# EAGLE design MCUBOARD-2-V.1.0 (EAGLE 5.06)

## Sheet 1 of 3
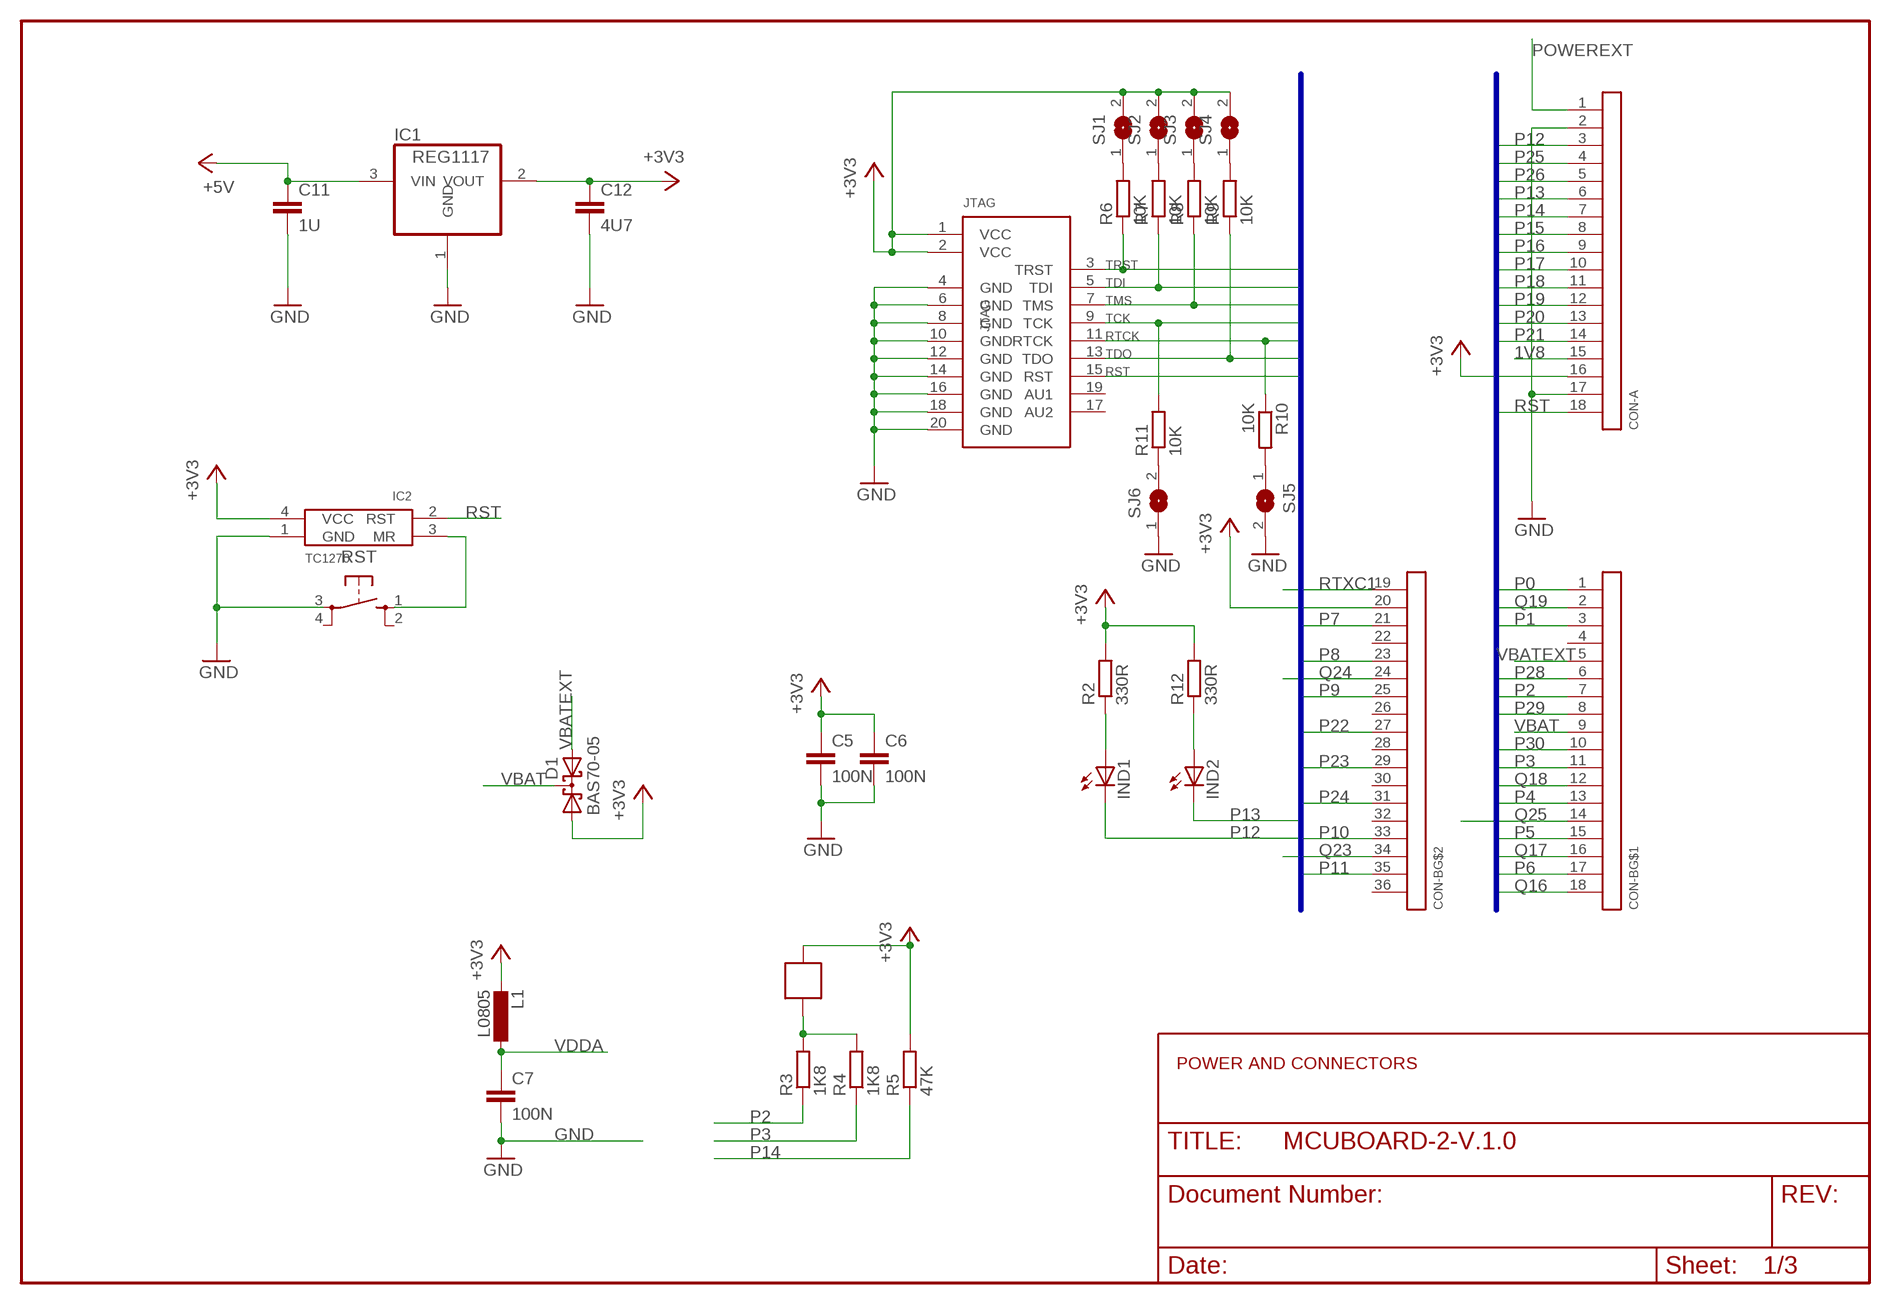
[diagram p0: schematic, sheet 1]

### Parts
C5  100N  C-EUC0805  [C0805]
C6  100N  C-EUC0805  [C0805]
C7  100N  C-EUC0603  [C0603]
C11  1U  C-EUC0805  [C0805]
C12  4U7  C-EUC0805  [C0805]
CON-A  CON18ARMCON  [CON-ARMED-18-1]
CON-B  CON18-2  [CON-ARMED-18-2]
D1  BAS70-05  [SOT23]
IC1  REG1117  [SOT223]
IC2  TC1270  [SOT143R_INFINEON]
IND1  LEDCHIPLED_0805  [CHIPLED_0805]
IND2  LEDCHIPLED_0805  [CHIPLED_0805]
JMP2  SOLDERJUMPER  [SOLDERJUMP1]
JTAG  ARM-JTAGVERTIKAL  [ML20]
L1  L0805  [C0805]
R2  330R  R-EU_M0805  [M0805]
R3  1K8  R-EU_M0805  [M0805]
R4  1K8  R-EU_M0805  [M0805]
R5  47K  R-EU_M0805  [M0805]
R6  10K  R-EU_M0805  [M0805]
R7  10K  R-EU_M0805  [M0805]
R8  10K  R-EU_M0805  [M0805]
R9  10K  R-EU_M0805  [M0805]
R10  10K  R-EU_M0805  [M0805]
R11  10K  R-EU_M0805  [M0805]
R12  330R  R-EU_M0805  [M0805]
RST  10XXSMD  [B3F-10XX-SMD]
SJ1  SJ  [SJ]
SJ2  SJ  [SJ]
SJ3  SJ  [SJ]
SJ4  SJ  [SJ]
SJ5  SJ  [SJ]
SJ6  SJ  [SJ]

### Nets
1V8: CON-A.15
+3V3: C5.1 C6.1 C12.1 CON-A.16 CON-B.20 D1.1(A1) IC1.2(VOUT) IC2.4(VCC) JMP2.2 JTAG.1(VCC) JTAG.2(VCC) L1.2 R2.2 R5.2 R12.2 SJ1.2 SJ2.2 SJ3.2 SJ4.2 ; also sheet 3
+5V: C11.1 IC1.3(VIN) ; also sheet 2
GND: C5.2 C6.2 C7.2 C11.2 C12.2 CON-A.2 CON-A.17 IC1.1(GND) IC2.1(GND) JTAG.4(GND) JTAG.6(GND) JTAG.8(GND) JTAG.10(GND) JTAG.12(GND) JTAG.14(GND) JTAG.16(GND) JTAG.18(GND) JTAG.20(GND) RST.3 SJ5.2 SJ6.1 ; also sheet 2,3
N$1: IC2.3(MR) RST.1
N$2: R6.2 SJ1.1
N$3: IND1.A R2.1
N$5: R7.2 SJ2.1
N$6: R8.2 SJ3.1
N$7: R9.2 SJ4.1
N$8: R10.2 SJ5.1
N$9: R11.1 SJ6.2
N$12: IND2.A R12.1
N$13: JMP2.1 R3.2 R4.2
P0: CON-B.1 ; also sheet 3
P1: CON-B.3 ; also sheet 3
P2: CON-B.7 R3.1 ; also sheet 3
P3: CON-B.11 R4.1 ; also sheet 3
P4: CON-B.13 ; also sheet 3
P5: CON-B.15 ; also sheet 3
P6: CON-B.17 ; also sheet 3
P7: CON-B.21 ; also sheet 3
P8: CON-B.23 ; also sheet 3
P9: CON-B.25 ; also sheet 3
P10: CON-B.33 ; also sheet 3
P11: CON-B.35 ; also sheet 3
P12: CON-A.3 IND1.C ; also sheet 3
P13: CON-A.6 IND2.C ; also sheet 3
P14: CON-A.7 R5.1 ; also sheet 3
P15: CON-A.8 ; also sheet 3
P16: CON-A.9 ; also sheet 3
P17: CON-A.10 ; also sheet 3
P18: CON-A.11 ; also sheet 3
P19: CON-A.12 ; also sheet 3
P20: CON-A.13 ; also sheet 3
P21: CON-A.14 ; also sheet 3
P22: CON-B.27 ; also sheet 3
P23: CON-B.29
P24: CON-B.31
P25: CON-A.4 ; also sheet 3
P26: CON-A.5
P28: CON-B.6 ; also sheet 3
P29: CON-B.8 ; also sheet 3
P30: CON-B.10 ; also sheet 3
POWEREXT: CON-A.1 ; also sheet 2
Q16: CON-B.18 ; also sheet 3
Q17: CON-B.16 ; also sheet 3
Q18: CON-B.12 ; also sheet 3
Q19: CON-B.2 ; also sheet 3
Q23: CON-B.34 ; also sheet 3
Q24: CON-B.24 ; also sheet 3
Q25: CON-B.14 ; also sheet 3
RST: CON-A.18 IC2.2(RST) JTAG.15(RST) ; also sheet 3
RTCK: JTAG.11(RTCK) R10.1 ; also sheet 3
RTXC1: CON-B.19 ; also sheet 3
TCK: JTAG.9(TCK) R11.2 ; also sheet 3
TDI: JTAG.5(TDI) R7.1 ; also sheet 3
TDO: JTAG.13(TDO) R9.1 ; also sheet 3
TMS: JTAG.7(TMS) R8.1 ; also sheet 3
TRST: JTAG.3(TRST) R6.1 ; also sheet 3
VBAT: CON-B.9 D1.3(C) ; also sheet 3
VBATEXT: CON-B.5 D1.2(A2)
VDDA: C7.1 L1.1 ; also sheet 3
Unconnected: CON-B.4 CON-B.22 CON-B.26 CON-B.28 CON-B.30 CON-B.32 CON-B.36 JTAG.17(AU2) JTAG.19(AU1) RST.2 RST.4

### Buses
P[0..31],Q[16..31],RST

### Notes on the sheet
- POWER AND CONNECTORS

## Sheet 2 of 3
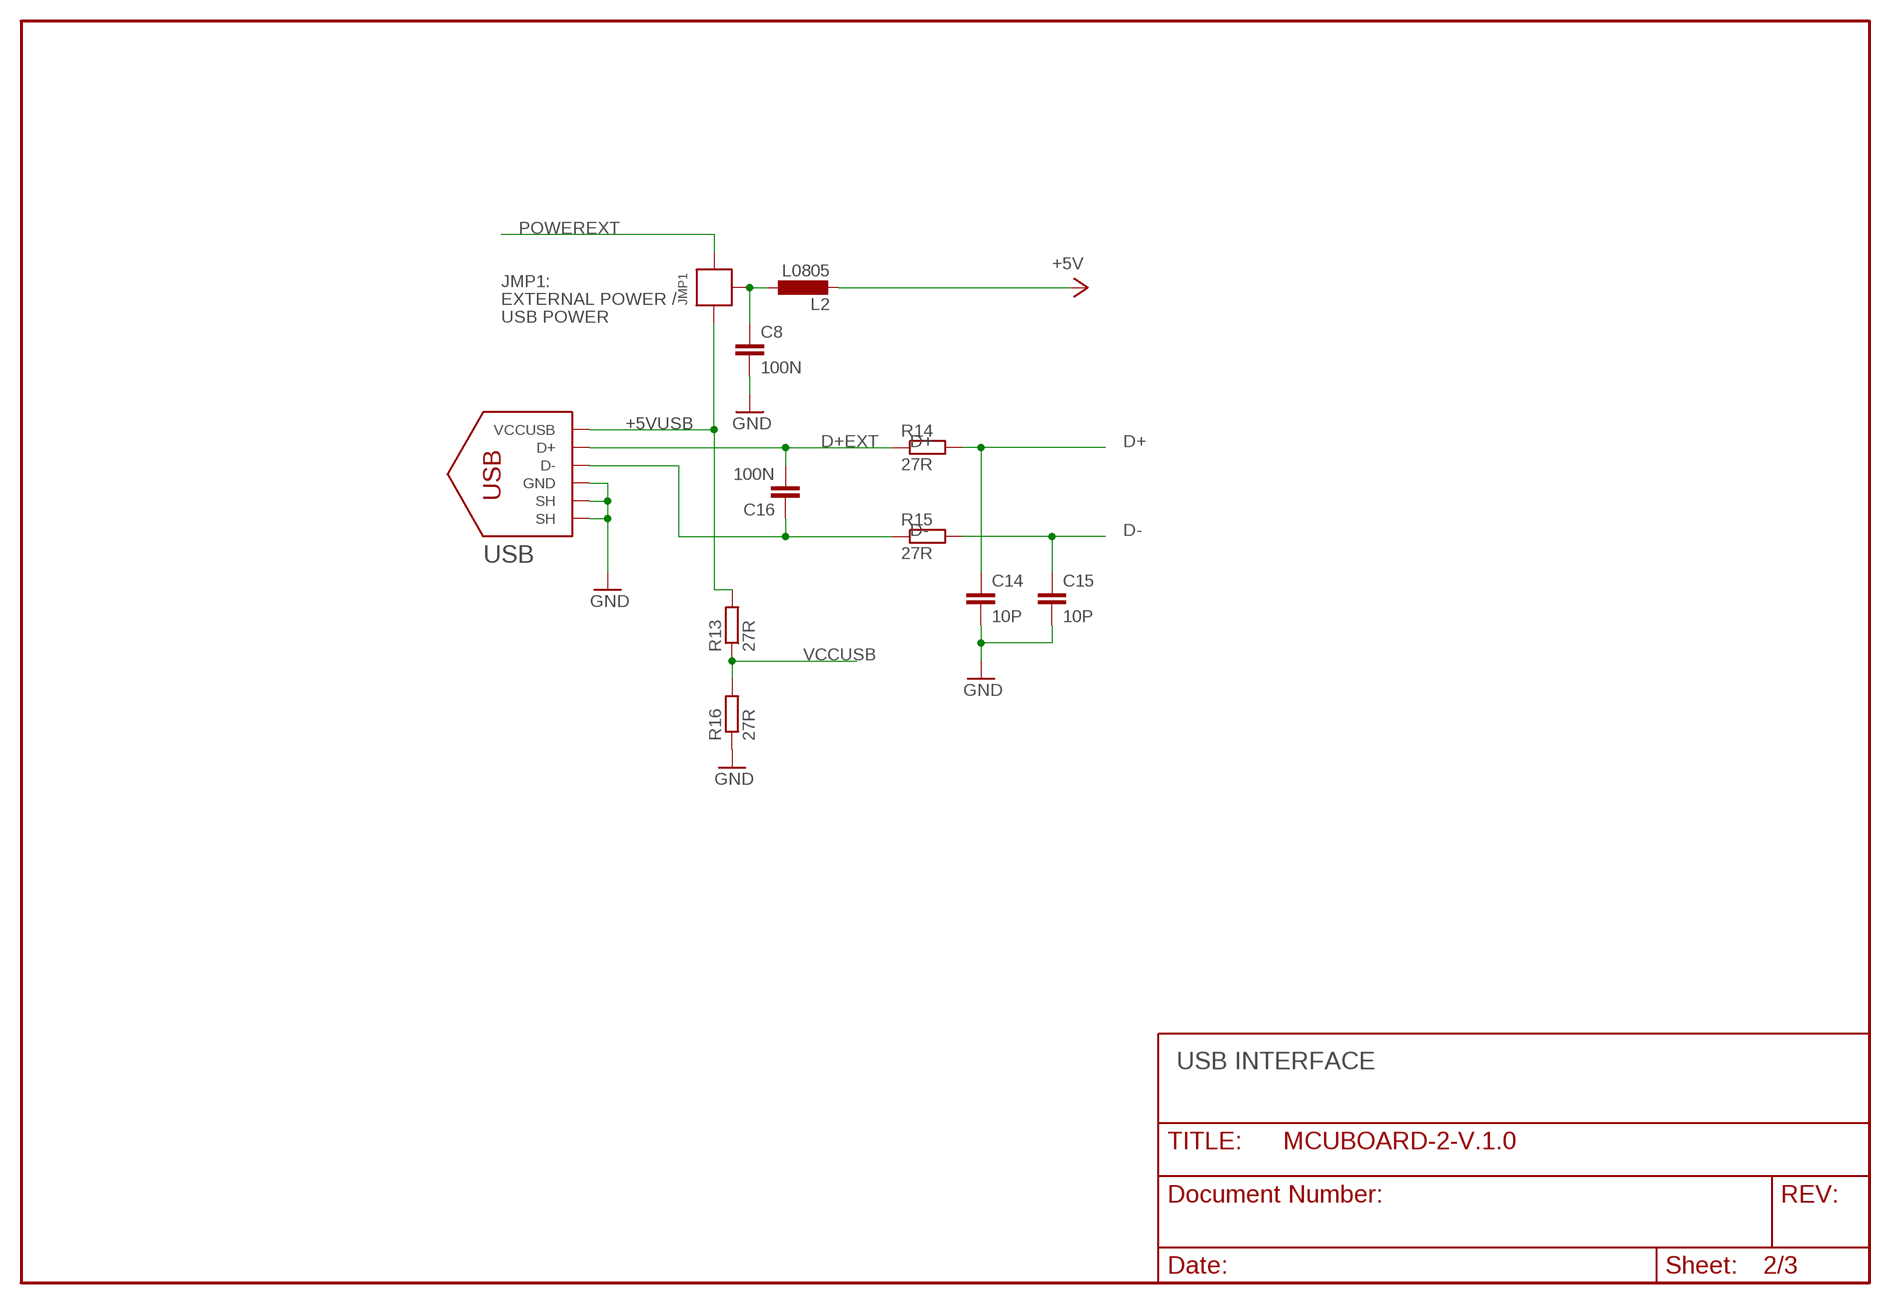
[diagram p1: schematic, sheet 2]

### Parts
C8  100N  C-EUC0805  [C0805]
C14  10P  C-EUC0805  [C0805]
C15  10P  C-EUC0805  [C0805]
C16  100N  C-EUC0805  [C0805]
JMP1  JUMPER3  [SOLDERJUMP3-1]
L2  L0805  [C0805]
R13  27R  R-EU_R0805  [R0805]
R14  27R  R-EU_R0805  [R0805]
R15  27R  R-EU_R0805  [R0805]
R16  27R  R-EU_R0805  [R0805]
USB  USBCONNMINI-B-HOLE  [USB-MB-H]

### Nets
+5V: L2.2 ; also sheet 1
+5VUSB: JMP1.3 R13.2 USB.VBUS(VCCUSB)
D+: C14.1 R14.2 ; also sheet 3
D+EXT: C16.2 R14.1 USB.D+ ; also sheet 3
D-: C15.1 R15.2 ; also sheet 3
D-EXT: C16.1 R15.1 USB.D-
GND: C8.2 C14.2 C15.2 R16.1 USB.GND USB.GND@1(SH) USB.GND@2(SH) ; also sheet 1,3
N$14: C8.1 JMP1.2 L2.1
POWEREXT: JMP1.1 ; also sheet 1
VCCUSB: R13.1 R16.2 ; also sheet 3

### Notes on the sheet
- JMP1:
- EXTERNAL POWER /
- USB POWER
- USB INTERFACE

## Sheet 3 of 3
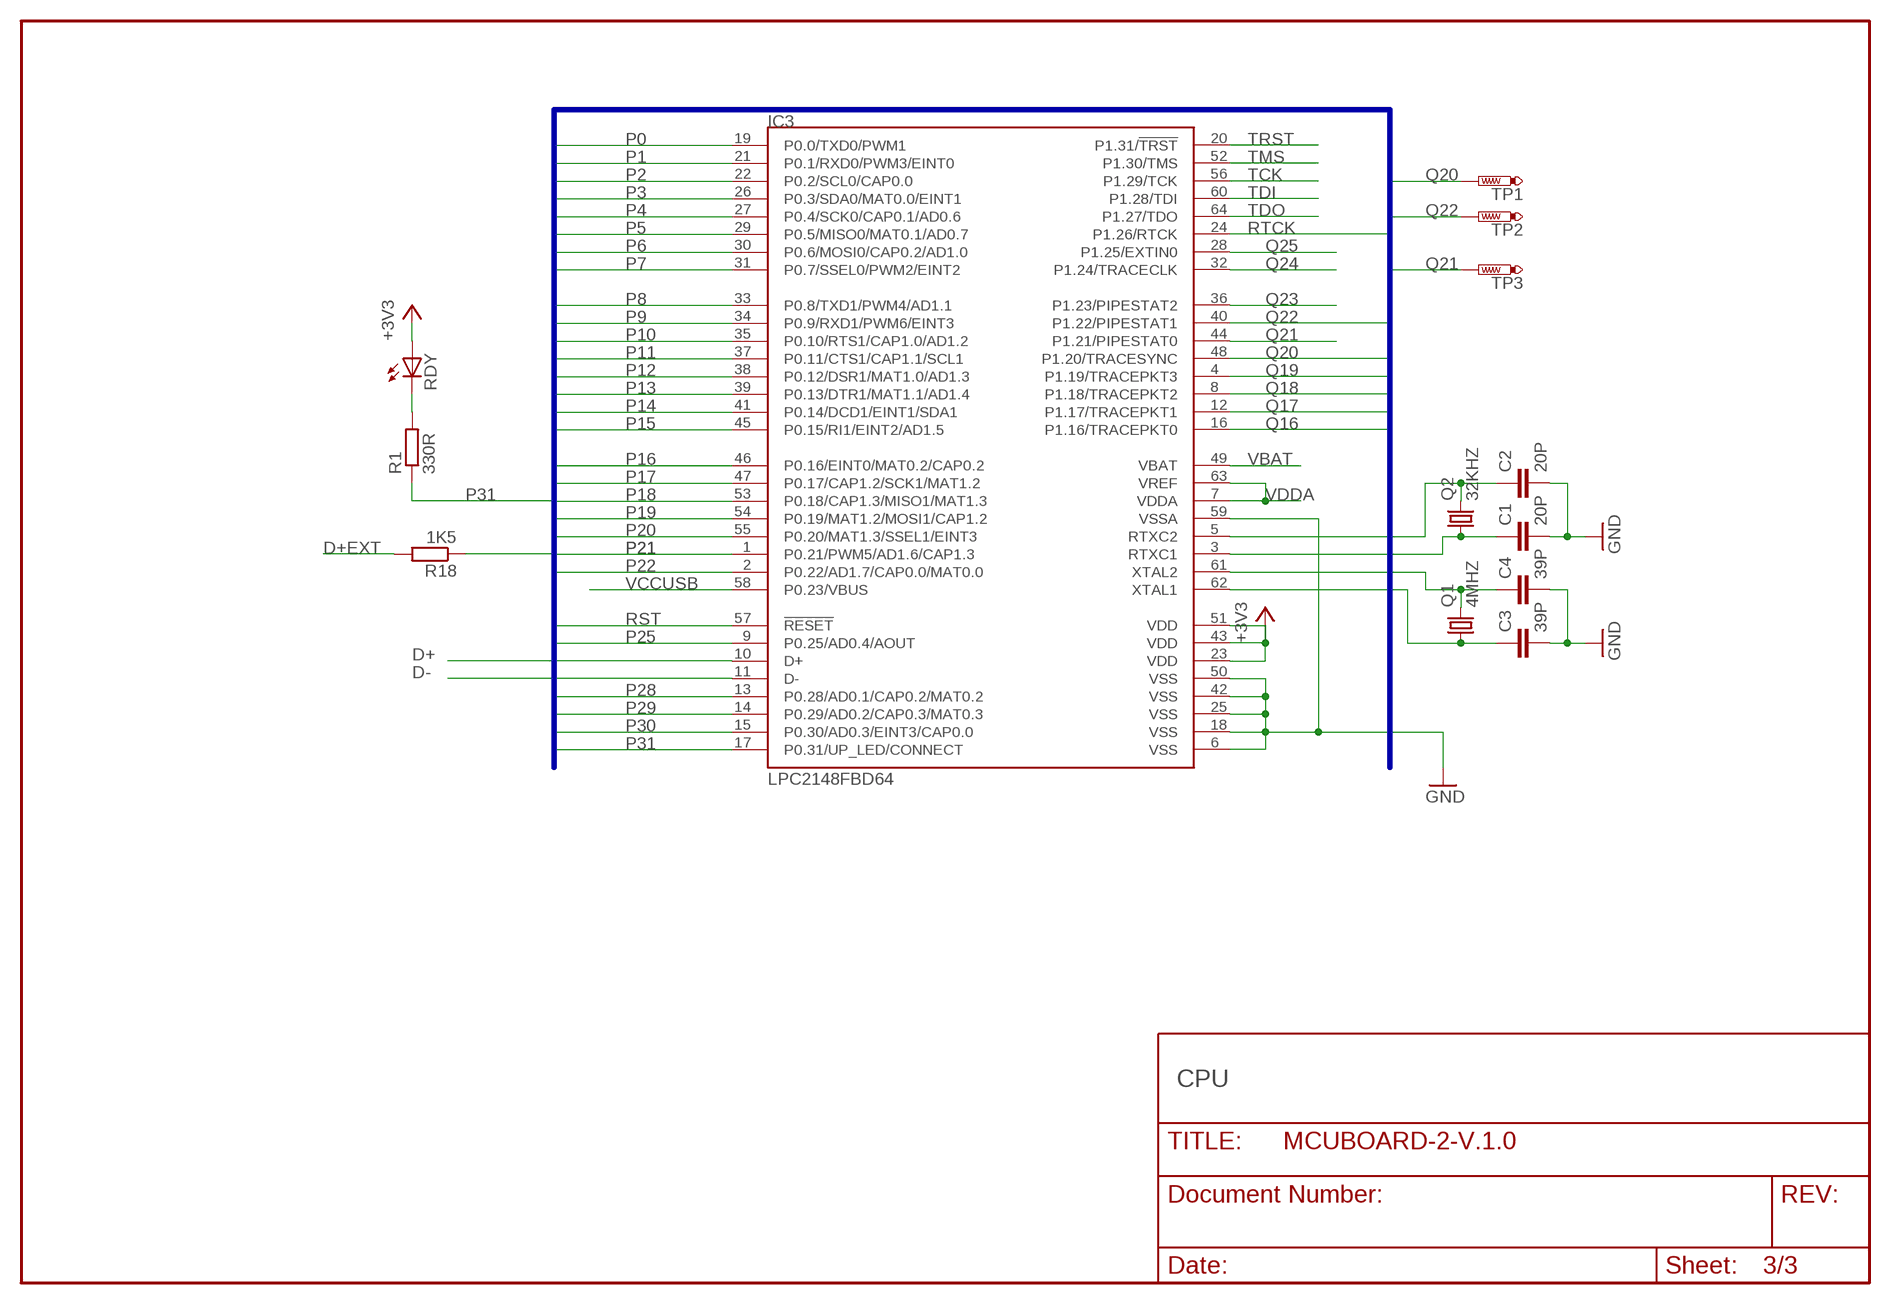
[diagram p2: schematic, sheet 3]

### Parts
C1  20P  C-EUC0603K  [C0603K]
C2  20P  C-EUC0603K  [C0603K]
C3  39P  C-EUC0603K  [C0603K]
C4  39P  C-EUC0603K  [C0603K]
IC3  LPC2148FBD64  [TSQFP50P1200X1200X160-64N]
Q1  4MHZ  CRYTALHC49S  [HC49/S]
Q2  32KHZ  CRYTALTC26V  [TC26V]
R1  330R  R-EU_M0805  [M0805]
R18  1K5  R-EU_M0805  [M0805]
RDY  LEDCHIPLED_0805  [CHIPLED_0805]
TP1  PTR1B1,27  [B1,27]
TP2  PTR1B1,27  [B1,27]
TP3  PTR1B1,27  [B1,27]

### Nets
+3V3: IC3.23(VDD) IC3.43(VDD) IC3.51(VDD) RDY.A ; also sheet 1
D+: IC3.10(D+) ; also sheet 2
D+EXT: R18.2 ; also sheet 2
D-: IC3.11(D-) ; also sheet 2
GND: C1.2 C2.2 C3.2 C4.2 IC3.6(VSS) IC3.18(VSS) IC3.25(VSS) IC3.42(VSS) IC3.50(VSS) IC3.59(VSSA) ; also sheet 1,2
N$11: R1.2 RDY.C
P0: IC3.19(P0.0/TXD0/PWM1) ; also sheet 1
P1: IC3.21(P0.1/RXD0/PWM3/EINT0) ; also sheet 1
P2: IC3.22(P0.2/SCL0/CAP0.0) ; also sheet 1
P3: IC3.26(P0.3/SDA0/MAT0.0/EINT1) ; also sheet 1
P4: IC3.27(P0.4/SCK0/CAP0.1/AD0.6) ; also sheet 1
P5: IC3.29(P0.5/MISO0/MAT0.1/AD0.7) ; also sheet 1
P6: IC3.30(P0.6/MOSI0/CAP0.2/AD1.0) ; also sheet 1
P7: IC3.31(P0.7/SSEL0/PWM2/EINT2) ; also sheet 1
P8: IC3.33(P0.8/TXD1/PWM4/AD1.1) ; also sheet 1
P9: IC3.34(P0.9/RXD1/PWM6/EINT3) ; also sheet 1
P10: IC3.35(P0.10/RTS1/CAP1.0/AD1.2) ; also sheet 1
P11: IC3.37(P0.11/CTS1/CAP1.1/SCL1) ; also sheet 1
P12: IC3.38(P0.12/DSR1/MAT1.0/AD1.3) ; also sheet 1
P13: IC3.39(P0.13/DTR1/MAT1.1/AD1.4) ; also sheet 1
P14: IC3.41(P0.14/DCD1/EINT1/SDA1) ; also sheet 1
P15: IC3.45(P0.15/RI1/EINT2/AD1.5) ; also sheet 1
P16: IC3.46(P0.16/EINT0/MAT0.2/CAP0.2) ; also sheet 1
P17: IC3.47(P0.17/CAP1.2/SCK1/MAT1.2) ; also sheet 1
P18: IC3.53(P0.18/CAP1.3/MISO1/MAT1.3) ; also sheet 1
P19: IC3.54(P0.19/MAT1.2/MOSI1/CAP1.2) ; also sheet 1
P20: IC3.55(P0.20/MAT1.3/SSEL1/EINT3) ; also sheet 1
P21: IC3.1(P0.21/PWM5/AD1.6/CAP1.3) ; also sheet 1
P22: IC3.2(P0.22/AD1.7/CAP0.0/MAT0.0) R18.1 ; also sheet 1
P25: IC3.9(P0.25/AD0.4/AOUT) ; also sheet 1
P28: IC3.13(P0.28/AD0.1/CAP0.2/MAT0.2) ; also sheet 1
P29: IC3.14(P0.29/AD0.2/CAP0.3/MAT0.3) ; also sheet 1
P30: IC3.15(P0.30/AD0.3/EINT3/CAP0.0) ; also sheet 1
P31: IC3.17(P0.31/UP_LED/CONNECT) R1.1
Q16: IC3.16(P1.16/TRACEPKT0) ; also sheet 1
Q17: IC3.12(P1.17/TRACEPKT1) ; also sheet 1
Q18: IC3.8(P1.18/TRACEPKT2) ; also sheet 1
Q19: IC3.4(P1.19/TRACEPKT3) ; also sheet 1
Q20: IC3.48(P1.20/TRACESYNC) TP1.PP(TP)
Q21: IC3.44(P1.21/PIPESTAT0) TP3.PP(TP)
Q22: IC3.40(P1.22/PIPESTAT1) TP2.PP(TP)
Q23: IC3.36(P1.23/PIPESTAT2) ; also sheet 1
Q24: IC3.32(P1.24/TRACECLK) ; also sheet 1
Q25: IC3.28(P1.25/EXTIN0) ; also sheet 1
RST: IC3.57(!RESET) ; also sheet 1
RTCK: IC3.24(P1.26/RTCK) ; also sheet 1
RTXC1: C2.1 IC3.5(RTXC2) Q2.2 ; also sheet 1
RTXC2: C1.1 IC3.3(RTXC1) Q2.1
TCK: IC3.56(P1.29/TCK) ; also sheet 1
TDI: IC3.60(P1.28/TDI) ; also sheet 1
TDO: IC3.64(P1.27/TDO) ; also sheet 1
TMS: IC3.52(P1.30/TMS) ; also sheet 1
TRST: IC3.20(P1.31/!TRST) ; also sheet 1
VBAT: IC3.49(VBAT) ; also sheet 1
VCCUSB: IC3.58(P0.23/VBUS) ; also sheet 2
VDDA: IC3.7(VDDA) IC3.63(VREF) ; also sheet 1
X1: C4.1 IC3.61(XTAL2) Q1.2
X2: C3.1 IC3.62(XTAL1) Q1.1

### Buses
P[0..31],Q[16..31],RST

### Notes on the sheet
- CPU

## Library data of the parts
C1-C8 C11 C12 C14-C16 = turbod3:C-EU: CAPACITOR, European symbol
CON-A = turbod3:CON18
CON-B = turbod3:CON18-2
D1 = diode:BAS70-05: Silicon Schottky Diodes General-purpose diode for high-speed switching
IC1 = burr-brown:REG1117: 800mA and 1A Low Dropout (LDO) Positive Regulator 1.8V, 2.5V, 2.85V, 3.3V, 5V, and Adj
IC2 = turbod3:TC1270
IC3 = philips-5:LPC2148
IND1 IND2 RDY = turbod3:LED: LED OSRAM: - CHIPLED LG R971, LG N971, LY N971, LG Q971, LY Q971, LO R971, LY R971 LH N974, LH R974 LS Q976, LO Q976, LY Q976 LO Q996 - Hyper CHIPLED LW Q18S LB Q993, LB Q99A, LB R99A - SideLED LS A670, LO A670, LY A670, LG A670, LP A670 LB A673, LV A673, LT A673, LW A673 LH A674 LY A675 LS A676, LA A676, LO A676, LY A676, LW A676 LS A679, LY A679, LG A679 - Hyper Micro SIDELED® LS Y876, LA Y876, LO Y876, LY Y876 LT Y87S - SmartLED LW L88C, LW L88S LB L89C, LB L89S, LG L890 LS L89K, LO L89K, LY L89K LS L896, LA L896, LO L896, LY L896 - TOPLED LS T670, LO T670, LY T670, LG T670, LP T670 LSG T670, LSP T670, LSY T670, LOP T670, LYG T670 LG T671, LOG T671, LSG T671 LB T673, LV T673, LT T673, LW T673 LH T674 LS T676, LA T676, LO T676, LY T676, LB T676, LH T676, LSB T676, LW T676 LB T67C, LV T67C, LT T67C, LS T67K, LO T67K, LY T67K, LW E67C LS E67B, LA E67B, LO E67B, LY E67B, LB E67C, LV E67C, LT E67C LW T67C LS T679, LY T679, LG T679 LS T770, LO T770, LY T770, LG T770, LP T770 LB T773, LV T773, LT T773, LW T773 LH T774 LS E675, LA E675, LY E675, LS T675 LS T776, LA T776, LO T776, LY T776, LB T776 LHGB T686 LT T68C, LB T68C - Hyper Mini TOPLED® LB M676 - Mini TOPLED Santana® LG M470 LS M47K, LO M47K, LY M47K Source: http://www.osram.convergy.de LUXEON: - LUMILED® LXK2-PW12-R00, LXK2-PW12-S00, LXK2-PW14-U00, LXK2-PW14-V00 LXK2-PM12-R00, LXK2-PM12-S00, LXK2-PM14-U00 LXK2-PE12-Q00, LXK2-PE12-R00, LXK2-PE12-S00, LXK2-PE14-T00, LXK2-PE14-U00 LXK2-PB12-K00, LXK2-PB12-L00, LXK2-PB12-M00, LXK2-PB14-N00, LXK2-PB14-P00, LXK2-PB14-Q00 LXK2-PR12-L00, LXK2-PR12-M00, LXK2-PR14-Q00, LXK2-PR14-R00 LXK2-PD12-Q00, LXK2-PD12-R00, LXK2-PD12-S00 LXK2-PH12-R00, LXK2-PH12-S00 LXK2-PL12-P00, LXK2-PL12-Q00, LXK2-PL12-R00 Source: www.luxeon.com KINGBRIGHT: KA-3528ASYC Source: www.kingbright.com
JMP1 = turbod3:JUMPER3
JMP2 = turbod3:SOLDERJUMPER
JTAG = turbod3:ARM-JTAG
L1 L2 = turbod3:L
Q1 Q2 = turbod3:CRYTAL: CRYSTAL
R1-R16 R18 = turbod3:R-EU_: RESISTOR, European symbol
RST = turbod3:10XX
SJ1-SJ6 = jumper:SJ: SMD solder JUMPER
TP1-TP3 = testpad:PTR1: TEST PIN
USB = turbod3:USBCONN

## Board
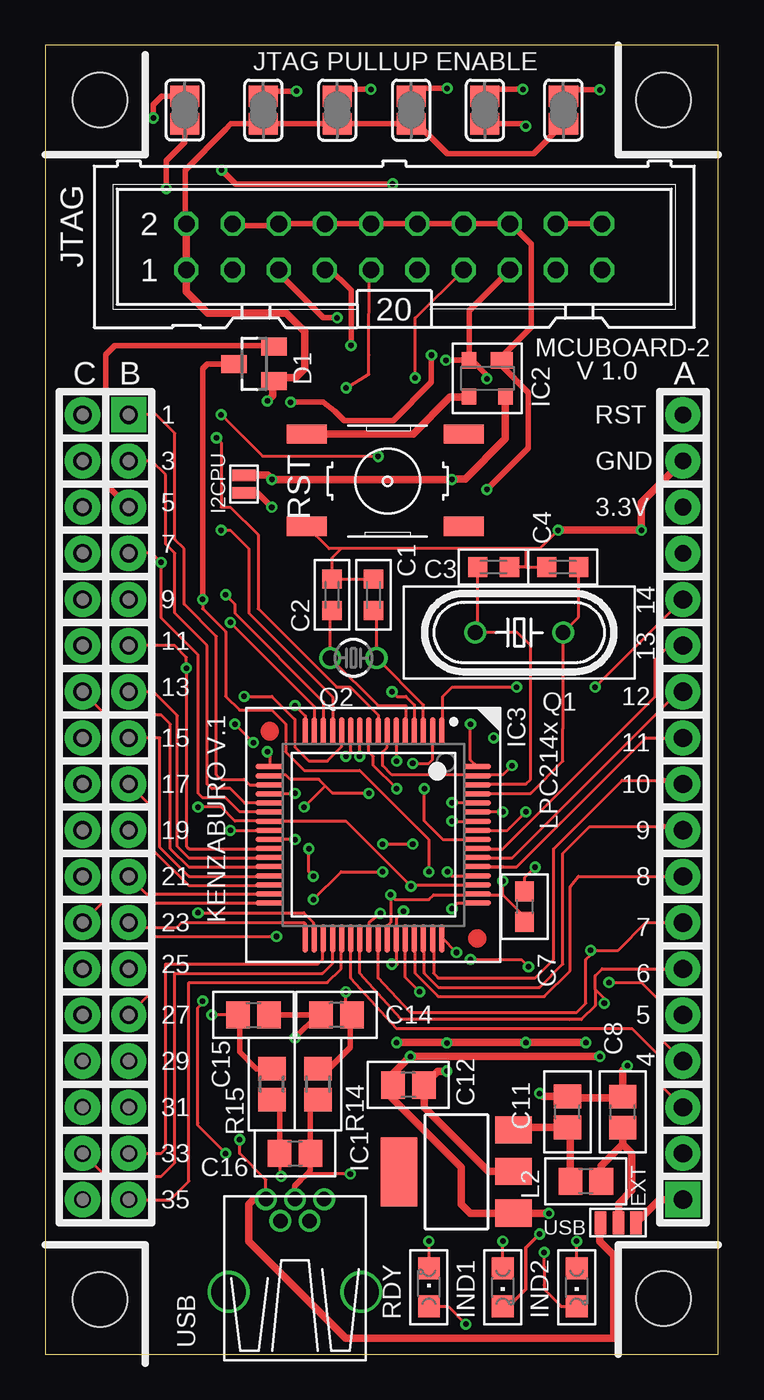
[diagram p3: board, top side]
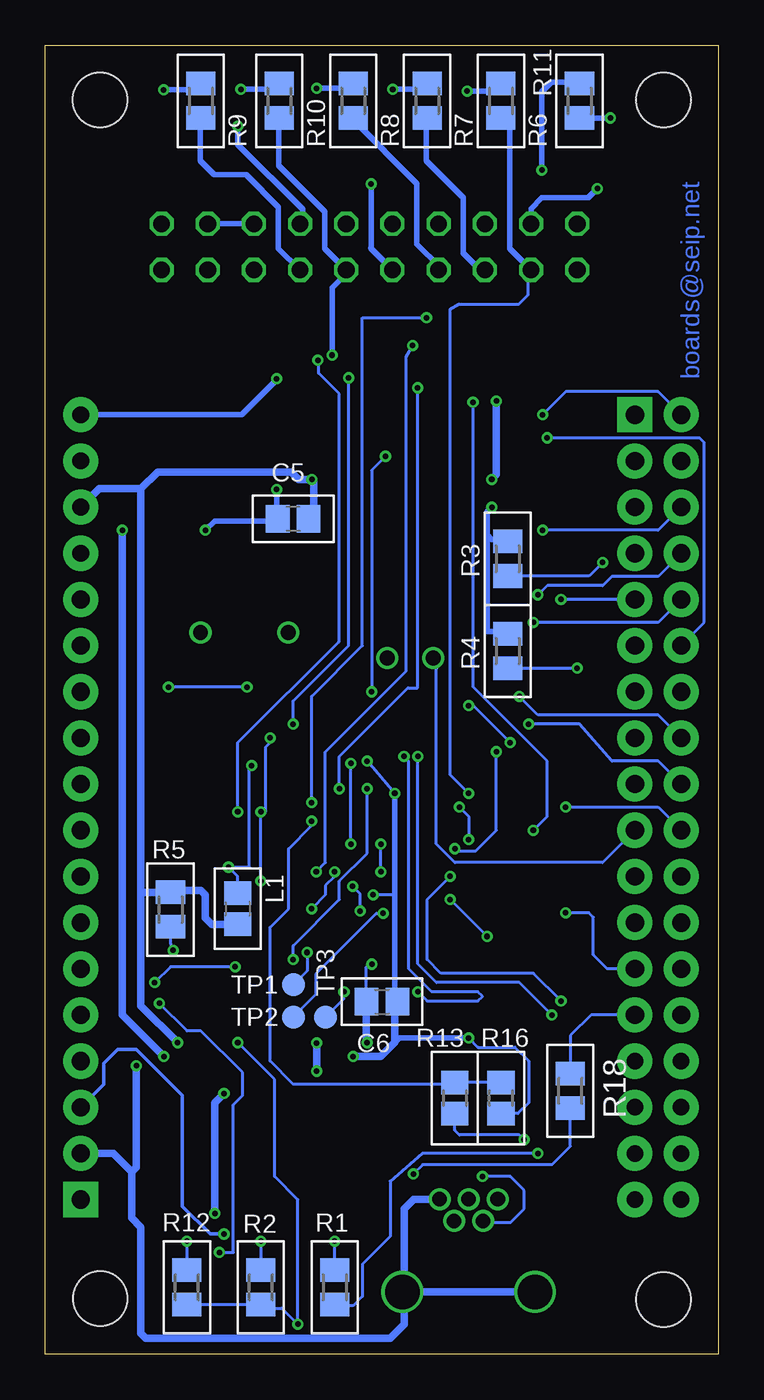
[diagram p4: board, bottom side, seen from below]

Size 37 x 72 mm. Coordinates in mm from the lower left corner, seen from the top.
Outline: 0,72 0,0 37,0 37,72 0,72
Copper layers (1*16): Top 0.035mm / dielectric 1.5mm / Bottom 0.035mm
Design rules "PCB-POOL": minimum track width 6mil, minimum drill 12mil, track to track 6mil, track to pad 6mil, pad to pad 6mil, via to via 6mil, smd to smd 6mil, copper to edge 20mil, drill to drill 8mil, minimum pad ring 8mil, minimum via ring 6mil, stop-mask expansion 3mil, vias tented up to drill 0mil, thermal gap 8mil
Holes 3 mm at 34,69 33.98,3.06 3,3 3,69

### Footprints (pad centres in the part's own frame; a part is rotated, then mirrored left to right if it is on the bottom)
C0603K = smd 1.05 x 1.08: 1 -0.875,0; 2 0.875,0
C0805 = smd 1.3 x 1.5: 1 -0.85,0; 2 0.85,0
C0603 = smd 1.1 x 1: 1 -0.85,0; 2 0.85,0
CON-ARMED-18-1 = drill 1 pad 1.93 square: 1 -21.59,0 | drill 1 pad 1.93 round: 2 -19.05,0; 3 -16.51,0; 4 -13.97,0; 5 -11.43,0; 6 -8.89,0; 7 -6.35,0; 8 -3.81,0; 9 -1.27,0; 10 1.27,0; 11 3.81,0; 12 6.35,0; 13 8.89,0; 14 11.43,0 | drill 0.914 pad 1.93 round: 15 13.97,0; 16 16.51,0; 17 19.05,0; 18 21.59,0
CON-ARMED-18-2 = drill 1 pad 1.93 square: 1 -21.59,1.27 | drill 1 pad 1.93 round: 2 -21.59,-1.27; 3 -19.05,1.27; 4 -19.05,-1.27; 5 -16.51,1.27; 6 -16.51,-1.27; 7 -13.97,1.27; 8 -13.97,-1.27; 9 -11.43,1.27; 10 -11.43,-1.27; 11 -8.89,1.27; 12 -8.89,-1.27; 13 -6.35,1.27; 14 -6.35,-1.27; 15 -3.81,1.27; 16 -3.81,-1.27; 17 -1.27,1.27; 18 -1.27,-1.27; 19 1.27,1.27; 20 1.27,-1.27; 21 3.81,1.27; 22 3.81,-1.27; 23 6.35,1.27; 24 6.35,-1.27; 25 8.89,1.27; 26 8.89,-1.27; 27 11.43,1.27; 28 11.43,-1.27 | drill 0.914 pad 1.93 round: 29 13.97,1.27; 30 13.97,-1.27; 31 16.51,1.27; 32 16.51,-1.27; 33 19.05,1.27; 34 19.05,-1.27; 35 21.59,1.27; 36 21.59,-1.27
SOT23 = smd 1 x 1.4: 1 -0.95,-1.1; 2 0.95,-1.1; 3 0,1.1
SOT223 = smd 1.499 x 2.007: 1 -2.261,-3.15; 2 0.025,-3.15; 3 2.311,-3.15 | smd 3.81 x 2.007: 4 0,3.15
SOT143R_INFINEON = smd 1.2 x 0.9: 1 -0.8,-1 | smd 0.8 x 0.9: 2 1,-1; 3 1,1; 4 -1,1
TSQFP50P1200X1200X160-64N = smd 1.55 x 0.3: 1 -5.7,3.75; 2 -5.7,3.25; 3 -5.7,2.75; 4 -5.7,2.25; 5 -5.7,1.75; 6 -5.7,1.25; 7 -5.7,0.75; 8 -5.7,0.25; 9 -5.7,-0.25; 10 -5.7,-0.75; 11 -5.7,-1.25; 12 -5.7,-1.75; 13 -5.7,-2.25; 14 -5.7,-2.75; 15 -5.7,-3.25; 16 -5.7,-3.75; 33 5.7,-3.75; 34 5.7,-3.25; 35 5.7,-2.75; 36 5.7,-2.25; 37 5.7,-1.75; 38 5.7,-1.25; 39 5.7,-0.75; 40 5.7,-0.25; 41 5.7,0.25; 42 5.7,0.75; 43 5.7,1.25; 44 5.7,1.75; 45 5.7,2.25; 46 5.7,2.75; 47 5.7,3.25; 48 5.7,3.75 | smd 0.3 x 1.55: 17 -3.75,-5.7; 18 -3.25,-5.7; 19 -2.75,-5.7; 20 -2.25,-5.7; 21 -1.75,-5.7; 22 -1.25,-5.7; 23 -0.75,-5.7; 24 -0.25,-5.7; 25 0.25,-5.7; 26 0.75,-5.7; 27 1.25,-5.7; 28 1.75,-5.7; 29 2.25,-5.7; 30 2.75,-5.7; 31 3.25,-5.7; 32 3.75,-5.7; 49 3.75,5.7; 50 3.25,5.7; 51 2.75,5.7; 52 2.25,5.7; 53 1.75,5.7; 54 1.25,5.7; 55 0.75,5.7; 56 0.25,5.7; 57 -0.25,5.7; 58 -0.75,5.7; 59 -1.25,5.7; 60 -1.75,5.7; 61 -2.25,5.7; 62 -2.75,5.7; 63 -3.25,5.7; 64 -3.75,5.7
CHIPLED_0805 = smd 1.2 x 1.2: A 0,-1.05; C 0,1.05
SOLDERJUMP3-1 = smd 1.27 x 0.635: 1 0,0.483; 2 0,-0.483; 3 0,-1.473
SOLDERJUMP1 = smd 1.27 x 0.635: 1 0,0.483; 2 0,-0.483
ML20 = drill 0.914 octagon: 1 -11.43,-1.27; 2 -11.43,1.27; 3 -8.89,-1.27; 4 -8.89,1.27; 5 -6.35,-1.27; 6 -6.35,1.27; 7 -3.81,-1.27; 8 -3.81,1.27; 9 -1.27,-1.27; 10 -1.27,1.27; 11 1.27,-1.27; 12 1.27,1.27; 13 3.81,-1.27; 14 3.81,1.27; 15 6.35,-1.27; 16 6.35,1.27; 17 8.89,-1.27; 18 8.89,1.27; 19 11.43,-1.27; 20 11.43,1.27
HC49/S = drill 0.813 round: 1 -2.413,0; 2 2.413,0
TC26V = drill 0.813 round: 1 -1.27,0; 2 1.27,0
M0805 = smd 1.3 x 1.6: 1 -0.95,0; 2 0.95,0
R0805 = smd 1.3 x 1.5: 1 -0.85,0; 2 0.85,0
B3F-10XX-SMD = smd 2.184 x 1.067: 1 -4.572,2.54; 2 4.064,2.54; 3 -4.572,-2.54; 4 4.064,-2.54
SJ = smd 1.168 x 1.6: 1 -0.762,0; 2 0.762,0
B1,27 = smd 1.27 x 1.27: PP 0,0
USB-MB-H = drill 0.8 round: D+ 5.1,0; D- 3.9,0.8; GND 5.1,-1.6; ID 3.9,-0.8; VBUS 5.1,1.6 | drill 1.9 round: GND@1 0,3.65; GND@2 0,-3.65

### Placement (x,y rotation side)
C1  18.04,41.77 90 top
C2  15.76,41.77 90 top
C3  24.65,43.3 0 top
C4  28.46,43.3 180 top
C5  23.38,45.95 180 bottom
C6  18.49,19.39 0 bottom
C7  26.34,24.61 270 top
C8  31.75,13.32 90 top
C11  28.71,13.33 90 top
C12  19.96,14.8 180 top
C14  16.01,18.66 180 top
C15  11.44,18.66 0 top
C16  13.72,11.04 0 top
CON-A  35.06,30.09 90 top
CON-B  3.31,30.09 270 top
D1  11.47,54.47 90 top
IC1  22.61,10.02 90 top
IC2  24.3,53.68 180 top
IC3  18.04,28.57 270 top
IND1  25.15,3.67 180 top
IND2  29.22,3.67 180 top
JMP1  32,7.23 270 top
JMP2  10.92,47.87 180 top
JTAG  19.18,60.92 0 top
L1  26.42,24.5 270 bottom
L2  29.72,9.51 180 top
Q1  26.06,39.7 0 top
Q2  16.94,38.3 180 top
R1  21.09,3.67 90 bottom
R2  25.15,3.67 270 bottom
R3  11.58,43.76 90 bottom
R4  11.58,38.68 90 bottom
R5  30.12,24.46 90 bottom
R6  11.95,68.95 90 bottom
R7  16.01,68.95 90 bottom
R8  20.08,68.95 90 bottom
R9  28.46,68.95 90 bottom
R10  24.14,68.95 90 bottom
R11  7.63,68.95 90 bottom
R12  29.22,3.67 270 bottom
R13  14.49,14.09 270 bottom
R14  14.99,14.85 90 top
R15  12.45,14.85 90 top
R16  11.95,14.09 90 bottom
R18  8.13,14.48 270 bottom
RDY  21.09,3.67 0 top
RST  18.95,48.08 0 top
SJ1  11.98,68.44 270 top
SJ2  16.04,68.44 270 top
SJ3  20.11,68.44 270 top
SJ4  28.49,68.44 270 top
SJ5  24.17,68.44 270 top
SJ6  7.66,68.44 90 top
TP1  23.37,20.32 0 bottom
TP2  23.37,18.54 0 bottom
TP3  21.59,18.54 0 bottom
USB  13.72,3.42 90 top

### Tracks (layer width: path | path; a pad name or v marks a point on that pad's centre or on a via)
+3V3  (via drill 0.3)
  Top 0.152: v8.39,30.09 9.66,30.09 10.42,29.33 IC3.23 16.53,29.32 v20.11,25.74 20.18,25.82 IC3.51 23.7,25.77 | 19.31,22.89 IC3.43 | v19.05,21.45 arc-274 19.18,21.33 19.31,21.45 19.31,22.89 | 19.31,22.89 19.31,23.99 v19.69,24.38 | 21.09,2.65 RDY.A 22.14,2.62 v23.12,1.64
  Top 0.305: 25.3,52.14 25.3,52.4 IC2.4 | JTAG.2 7.75,62.27 | 7.75,62.15 | 7.75,62.15 JTAG.2 | 7.75,62.15 | JTAG.2 7.75,62.17 7.68,62.09 7.68,65.14 9.92,67.38 9.92,67.4 10.2,67.68 SJ1.2 | 12.49,53.46 12.55,53.52 | 12.55,53.52 D1.1 | 12.55,53.52 12.74,53.71 | SJ1.2 11.73,67.68 | SJ1.2 SJ2.2 SJ3.2 20.46,67.68 22.1,66.04 26.85,66.04 SJ4.2
  Top 0.406: 25.3,52.4 25.3,50.36 23.09,48.15 22.38,48.15 v22.35,48.12 | JTAG.2 7.7,62.19 | JTAG.2 | JTAG.2 7.8,62.19 | 7.75,62.15 JTAG.1 7.75,58.45 8.93,57.27 13.25,57.27 14.27,56.25 14.27,54.22 13.76,53.71 12.74,53.71 | v29.73,17.14 v26.42,17.14 21.85,17.14 | 21.85,17.14 v19.31,17.14 | 21.85,17.14 v22.08,17.11 | 12.49,53.46 12.49,52.73 v12.2,52.44 | v22.35,48.12 v12.45,48.12 12.22,48.35 JMP2.2 | v22.35,48.12 v22.36,48.12 | 21.08,14.6 20.83,14.85 20.83,14.82 C12.1 | IC1.2 24.36,10.05 20.83,13.58 20.83,14.79 C12.1 | v22.08,15.57 21.57,15.57 C12.1
  Bottom 0.152: CON-B.20 3.31,30.09 v8.39,30.09 | v19.05,21.45 19.34,21.3 C6.1 | v19.69,24.38 19.69,25.33 v20.11,25.74 | R12.2 R2.2 25.05,2.62 25.02,2.66 25.02,2.53 24.01,2.53 v23.12,1.64 23.12,8.5 24.39,9.77 24.39,15.1 v26.42,17.14
  Bottom 0.305: C5.1 22.52,45.81 22.5,45.79 22.25,46.05
  Bottom 0.406: v19.31,17.14 19.34,17.17 C6.1 | v29.73,17.14 31.76,19.17 31.76,25.26 | R5.2 31.62,25.41 31.76,25.26 | 31.76,25.26 31.76,47.62 | 31.76,47.62 30.84,48.54 23.47,48.54 23.06,48.12 v22.35,48.12 22.25,48.02 22.25,46.05 | R5.2 30.07,25.35 | L1.2 27.86,23.65 28.2,23.99 28.2,25.26 28.46,25.52 30.01,25.52 R5.2 | v22.08,17.11 v22.08,15.57 | 31.76,47.62 34.04,47.62 CON-A.16 | v12.2,52.44 12.2,48.38 v12.45,48.12
+5V
  Top 0.152: 24.97,12.31 IC1.3
  Top 0.406: L2.2 28.87,12.32 C11.1 25.13,12.48 IC1.3
+5VUSB  (via drill 0.3)
  Top 0.152: USB.VBUS 12.12,9.59 10.68,11.04 v10.68,11.8
  Top 0.406: USB.VBUS 11.46,8.52 11.18,8.25 11.18,6.21 16.52,0.88 31.25,0.88 31.25,5.44 30.48,6.21 30.48,7.18 JMP1.3
  Bottom 0.152: v10.68,11.8 10.93,12.06 14.23,12.06 14.49,12.31 R13.2
D+  (via drill 0.3)
  Top 0.152: IC3.10 17.28,34.25 v17.28,32.88 | v16.52,19.93 16.52,19 C14.1
  Top 0.305: R14.2 15.59,15.7 16.77,16.88 16.77,18.57 C14.1
  Bottom 0.152: v17.28,32.88 17.03,32.63 17.03,21.2 15.76,19.93 13.22,19.93 12.96,19.68 13.22,19.42 16.01,19.42 v16.52,19.93
D+EXT  (via drill 0.3)
  Top 0.152: v16.76,9.91 14.37,9.91 14.04,9.58
  Top 0.305: USB.D+ 13.72,9.26 14.04,9.58 14.36,9.9 14.57,10.11 C16.2 14.57,13.58 R14.1
  Bottom 0.152: R18.2 8.13,11.43 9.14,10.41 16.26,10.41 v16.76,9.91
D-  (via drill 0.3)
  Top 0.152: IC3.11 16.79,33.16 v16.52,32.88 | C15.1 v9.15,18.66
  Top 0.305: R15.2 11.6,15.7 10.68,16.63 10.68,18.57 C15.1
  Bottom 0.152: v16.52,32.88 16.52,21.45 15.5,20.44 10.93,20.44 v9.15,18.66
D-EXT  (via drill 0.3)
  Top 0.152: C16.1 12.92,10.99 12.92,9.81 v12.96,9.77
  Top 0.305: C16.1 12.87,13.58 R15.1
  Bottom 0.152: v12.96,9.77 11.44,9.77 10.68,9.01 10.68,7.99 11.44,7.23 12.83,7.23 USB.D-
GND  (via drill 0.3)
  Top 0.152: IC3.18 12.39,31.87 13.22,31.87 13.47,31.61 15.04,31.61 15.4,31.26 | 25.8,43 25.66,43.14 | 18.8,22.88 IC3.42 18.78,23.54 18.98,23.74 v18.98,25.26 19.24,25.01 21.09,25.01 21.34,25.26 23.69,25.26 IC3.50 23.79,25.26 25.15,25.26 | IC3.25 v13.72,28.32 v13.72,28.31 | IC3.6 19.31,34.25 v19.31,32.63 | 15.4,31.26 v14.23,30.09 | v28.2,45.33 27.19,44.31 26.42,44.31 | C7.2 26.34,24.07 25.15,25.26 | IC3.59 24.88,29.82 v25.15,29.84 | 25.15,25.26 v25.15,26.03 | v17.79,30.85 15.8,30.85 15.4,31.26 | 26.42,44.31 26.42,43.3 | 26.42,43.3 C4.2 | 26.42,43.3 C3.2 | C1.2 C2.2 15.76,43.81 16.26,44.31 | 26.42,44.31 16.26,44.31 | 16.26,44.31 15.6,44.31 RST.3
  Top 0.305: v24.28,47.57 26.57,49.86 26.57,52.9 25.1,54.37 IC2.1 25.1,54.89 26.71,56.51 26.71,61.08 25.6,62.19 JTAG.16 25.38,62.19 | JTAG.4 10.39,62.09 12.93,62.09 JTAG.6 JTAG.8 JTAG.10 JTAG.12 | JTAG.12 20.5,62.19 | JTAG.12 | JTAG.12 JTAG.14 25.38,62.19 | JTAG.20 30.71,62.19 | JTAG.20 | JTAG.18 JTAG.20 | 25.38,62.19 25.78,62.19 | v6.65,64.13 6.65,65.65 7.66,66.67 SJ6.1 | C15.2 C14.2 14.99,18.66 v13.72,17.39 | SJ5.2 26.3,67.68 v26.42,67.56
  Top 0.406: C3.2 25.8,43 | C4.2 27.47,43.39 | v20.07,16.37 v30.49,16.37 | v28.2,45.33 v32.77,45.33 32.77,46.85 CON-A.17 | v20.07,16.37 20.13,16.32 | v20.07,16.37 19.05,15.35 19.05,14.87 C12.2 19.05,14.74 19.05,14.09 22.86,10.28 22.86,8.25 23.37,7.74 25.73,7.74 | 25.43,7.76 IC1.1 25.73,7.74 | v32,15.87 31.75,15.61 C8.2 31.75,14.09 28.7,14.09 28.7,14.17 C11.2 27.34,14.18 v27.18,14.34 | 25.73,7.74 27.43,7.74 v27.69,7.74
  Bottom 0.152: v17.79,30.85 v19.31,32.63 | v13.72,28.31 13.72,29.58 v14.23,30.09 | v25.15,26.03 v25.15,29.84 24.89,29.84 24.89,33.39 24.64,33.65 v24.65,33.9 | R16.1 11.02,13.24 10.42,13.83 10.42,16.12 11.18,16.88 13.22,16.88 v13.72,17.39 | 17.79,25.26 v18.98,25.26
  Bottom 0.305: JTAG.16 JTAG.18 | C5.2 24.23,45.85 24.28,45.79 v24.28,47.57 | JTAG.4 10.29,63.02 9.69,63.62 7.15,63.62 v6.65,64.13 | v13.72,17.39 17.53,17.39 17.91,17.01 | 24.65,45.84 27.69,45.84 v28.2,45.33 | C6.2 17.79,19.39 17.79,25.26 v17.79,30.85 | v26.42,67.56 26.42,66.55 22.86,62.99 22.86,62.32 JTAG.14
  Bottom 0.406: C6.2 17.79,19.24 17.79,17.14 17.91,17.01 18.55,16.37 v20.07,16.37 | v30.49,16.37 32.77,18.66 v32.77,45.33 | 30.99,0.88 18.04,0.88 17.28,1.64 17.28,3.33 USB.GND@2 | 30.99,0.88 31.25,0.88 | 32.27,10.02 33.28,11.04 CON-A.2 | 24.65,45.84 24.34,45.84 C5.2 | USB.GND 16.75,8.52 17.28,7.99 17.28,3.51 USB.GND@2 | USB.GND@1 USB.GND@2 | 32.27,10.02 32.27,7.49 31.75,6.98 31.75,1.13 31.5,0.88 30.99,0.88 | v32,15.87 32,10.29 32.27,10.02 | v27.69,7.74 27.69,13.83 v27.18,14.34
N$1
  Top 0.406: RST.1 20.22,50.62 22.25,52.65 23.26,52.65 IC2.3
N$2  (via drill 0.3)
  Top 0.305: SJ1.1 11.98,69.48 v13.81,69.48
  Bottom 0.305: R6.2 11.95,69.72 12.18,69.48 v13.81,69.48
N$3  (via drill 0.3)
  Top 0.152: IND1.A v25.15,6.21
  Bottom 0.152: v25.15,6.21 R2.1
N$5  (via drill 0.3)
  Top 0.305: v17.9,69.59 16.43,69.59 SJ2.1
  Bottom 0.305: R7.2 16.31,69.9 16.63,69.59 v17.9,69.59
N$6  (via drill 0.3)
  Top 0.305: SJ3.1 20.11,69.26 20.49,69.64 v22.09,69.64
  Bottom 0.305: R8.2 20.25,69.9 20.51,69.64 v22.09,69.64
N$7  (via drill 0.3)
  Top 0.305: SJ4.1 28.54,69.21 28.9,69.56 v30.5,69.56
  Bottom 0.305: R9.2 28.56,69.9 28.9,69.56 v30.5,69.56
N$8  (via drill 0.3)
  Top 0.305: SJ5.1 24.12,69.21 24.5,69.59 v26.25,69.59
  Bottom 0.305: R10.2 24.14,69.87 24.43,69.59 v26.25,69.59
N$9  (via drill 0.3)
  Top 0.305: v5.93,68.01 5.93,68.75 6.39,69.21 7.59,69.21 7.61,69.18 7.64,69.21 SJ6.2
  Bottom 0.305: R11.1 5.95,68 v5.93,68.01
N$11  (via drill 0.3)
  Top 0.152: v21.09,6.21 RDY.C
  Bottom 0.152: R1.2 v21.09,6.21
N$12  (via drill 0.3)
  Top 0.152: IND2.A v29.22,6.21
  Bottom 0.152: v29.22,6.21 R12.1
N$13  (via drill 0.3)
  Top 0.305: JMP2.1 11.66,47.39 v12.45,46.6
  Bottom 0.305: 12.7,46.35 v12.45,46.6 | 12.7,46.35 12.7,39.74 11.69,39.74 R4.2 | 12.7,46.35 12.7,45.08 12.45,44.82 11.69,44.82 R3.2
N$14
  Top 0.406: JMP1.2 31.52,8.27 32.26,9.01 32.26,11.04 31.75,11.55 | 31.75,11.55 C8.1 | L2.1 30.57,10.37 31.75,11.55
P0
  Top 0.152: IC3.19 11.23,31.32 10.93,31.61 9.66,31.61 9.41,31.87 9.41,39.49 7.63,41.27 7.63,44.31 7.12,44.82 7.12,50.66 6.1,51.68 CON-B.1
P1
  Top 0.152: IC3.21 10.96,30.32 10.17,31.11 9.15,31.11 8.9,31.36 8.9,38.98 7.12,40.76 7.12,44.06 6.61,44.57 6.61,48.38 5.85,49.14 CON-B.3
P2  (via drill 0.3)
  Top 0.152: IC3.22 12.32,29.84 10.68,29.84 9.91,30.6 8.64,30.6 8.39,30.85 8.39,38.47 6.36,40.5 v6.36,43.55 5.85,44.06 CON-B.7
  Bottom 0.152: R3.1 7.1,42.81 v6.36,43.55
P3  (via drill 0.3)
  Top 0.152: CON-B.11 7.11,38.98 7.75,38.34 v7.75,37.73 7.77,37.82 7.77,27.92 7.88,27.8 12.33,27.8 IC3.26
  Bottom 0.152: R4.1 7.86,37.73 v7.75,37.73
P4
  Top 0.152: CON-B.13 5.95,36.44 7.26,35.12 7.26,27.92 7.88,27.3 12.32,27.3 IC3.27
P5
  Top 0.152: CON-B.15 6.29,33.9 6.29,27.87 7.88,26.28 12.31,26.28 IC3.29
P6
  Top 0.152: CON-B.17 5.85,30.09 5.85,27.8 7.88,25.77 12.3,25.77 IC3.30
P7
  Top 0.152: IC3.31 5.54,25.32 CON-B.21
P8
  Top 0.152: IC3.33 14.29,23.68 14.23,23.74 7.5,23.74 7.25,23.49 4.83,23.49 CON-B.23
P9  (via drill 0.3)
  Top 0.152: v8.39,24.27 14.21,24.27 14.74,23.74 14.74,22.92 IC3.34
  Bottom 0.152: CON-B.25 6.1,21.2 6.87,21.96 6.87,24.03 7.11,24.27 v8.39,24.27
P10
  Top 0.152: IC3.35 15.25,22.82 15.25,21.71 14.99,21.45 6.61,21.45 6.61,11.29 6.36,11.04 CON-B.33
P11
  Top 0.152: IC3.37 16.26,22.84 16.26,21.2 15.5,20.44 7.88,20.44 7.88,9.52 6.87,8.5 CON-B.35
P12  (via drill 0.3)
  Top 0.152: IC3.38 16.79,20.67 19.31,17.9 32.27,17.9 33.79,16.37 33.79,14.85 CON-A.3
  Top 0.203: IND1.C 25.48,2.62 26.42,3.56 26.42,5.84 v27.18,6.6
  Bottom 0.203: v27.18,6.6 27.94,6.6 29.46,8.13 29.46,14.22 32,16.76 33.03,16.76 33.79,16 33.79,14.85 CON-A.3
P13  (via drill 0.3)
  Top 0.152: 29.47,18.41 19.57,18.41 17.28,20.95 17.28,22.85 IC3.39 | CON-A.6 30.61,21.2 30.23,20.82 30.23,20.07 | 29.47,18.41 30.23,19.17 30.23,20.07 | IND2.C 28.36,2.62 27.43,3.56 27.43,3.81 27.43,4.83 v27.43,5.59 | 29.47,18.41 28.82,18.41 | v30.73,19.3 30.73,19.57 30.23,20.07
  Bottom 0.152: v27.43,5.59 26.67,5.59 26.67,13.72 26.16,14.22 26.16,15.49 28.45,17.78 29.21,17.78 v30.73,19.3
P14  (via drill 0.3)
  Top 0.152: CON-A.7 33.03,23.74 31.5,22.22 v29.98,22.22 29.98,21.96 29.73,21.71 29.73,19.3 29.22,18.79 20.07,18.79 18.29,20.7 IC3.41
  Bottom 0.152: v29.98,22.22 30.12,22.61 R5.1
P15
  Top 0.152: IC3.45 20.33,22.83 20.33,20.95 21.6,19.68 27.44,19.68 28.85,21.09 28.85,25.73 29.31,26.28 CON-A.8
P16
  Top 0.152: 34,29.03 29.93,29.03 28.46,27.55 28.46,21.45 27.19,20.18 21.6,20.18 20.84,20.95 20.84,22.82 IC3.46
  Top 0.305: 34,29.03 CON-A.9
P17
  Top 0.152: 34,31.57 31.71,31.57 27.95,27.8 27.95,21.71 26.93,20.69 21.6,20.69 21.34,20.95 21.34,22.81 IC3.47
  Top 0.305: 34,31.57 CON-A.10
P18
  Top 0.152: 25.18,26.82 IC3.53 23.77,26.79 25.92,26.79 33.03,33.9 CON-A.11
P19
  Top 0.152: CON-A.12 34.81,36.44 25.66,27.3 23.76,27.3 IC3.54
P20
  Top 0.152: CON-A.13 34.3,38.98 33.54,38.22 33.54,36.19 25.15,27.8 23.75,27.8 IC3.55
P21  (via drill 0.3)
  Top 0.152: v25.92,36.69 22.36,36.69 21.85,36.19 21.85,34.33 IC3.1 | v30.23,36.69 CON-A.14
  Bottom 0.152: v25.92,36.69 v30.23,36.69
P22  (via drill 0.3)
  Top 0.152: CON-B.27 5.85,19.93 5.85,22.98 v12.71,22.98 | v18.55,28.06 v20.2,28.06 | v14.74,25.01 16.26,26.53 v18.55,26.53 | IC3.2 21.29,32.7 21.09,32.5 v20.2,32.5
  Bottom 0.152: v12.71,22.98 v14.74,25.01 | v18.55,26.53 v18.55,28.06 | v20.2,28.06 v20.2,32.5 | CON-B.27 6.99,18.66 8.13,17.53 R18.1
P25  (via drill 0.3)
  Top 0.152: v26.57,21.31 26.17,21.71 v23.38,21.71 | IC3.9 17.79,33.14 18.04,32.88 18.04,32.38 v19.31,31.11 | v31,20.44 32.77,20.44 33.79,19.42 33.79,17.39 CON-A.4
  Bottom 0.152: v23.38,21.71 23.38,22.47 20.84,25.01 20.84,26.03 19.31,27.55 v19.31,31.11 | v26.57,21.31 30.12,21.31 v31,20.44
P28  (via drill 0.3)
  Top 0.152: IC3.13 15.79,36.15 11.18,40.76 11.18,44.31 10.17,45.33 v9.66,45.33
  Bottom 0.152: v9.66,45.33 3.31,45.33 CON-B.6
P29  (via drill 0.3)
  Top 0.152: IC3.14 15.29,35.89 10.42,40.76 10.42,41.27 v9.91,41.77
  Bottom 0.152: v9.91,41.77 9.41,42.28 6.36,42.28 5.85,42.79 3.31,42.79 CON-B.8
P30  (via drill 0.3)
  Top 0.152: IC3.15 14.79,35.63 v10.17,40.25
  Bottom 0.152: v10.17,40.25 3.31,40.25 CON-B.10
P31  (via drill 0.3)
  Top 0.152: IC3.17 12.34,33 v12.2,33.14 | v14.49,27.8 14.49,26.53 v14.74,26.28 | v8.64,19.42 8.64,19.31 8.38,19.05 8.38,12.7 8.38,12.57 v9.91,11.04
  Bottom 0.152: v12.2,33.14 12.2,28.82 13.34,27.68 14.36,27.68 v14.49,27.8 | v14.74,26.28 16.01,25.01 16.01,21.71 15.25,20.95 10.17,20.95 v8.64,19.42 | v9.91,11.04 16.26,11.04 18.04,9.52 18.04,6.47 19.57,4.94 19.57,3.17 20.07,2.66 21.02,2.66 R1.1
POWEREXT
  Top 0.406: 34.81,8.5 CON-A.1 33.76,8.5 JMP1.1
Q16  (via drill 0.3)
  Top 0.152: IC3.16 14.29,35.11 v13.72,35.68 | v10.42,34.66 v11.44,33.65
  Bottom 0.152: v13.72,35.68 13.47,35.68 v11.44,33.65 | v10.42,34.66 7.63,34.66 5.85,32.63 3.31,32.63 CON-B.18
Q17  (via drill 0.3)
  Top 0.152: IC3.12 16.29,33.42 15.5,32.63 14.49,32.63 13.72,33.39 13.72,34.92 12.45,36.19 v10.93,36.19
  Bottom 0.152: v10.93,36.19 9.91,35.17 3.31,35.17 CON-B.16
Q18  (via drill 0.3)
  Top 0.152: IC3.8 18.3,35.17 16.77,36.69 16.01,36.69 11.69,41.01 11.69,45.08 10.17,46.6 9.66,46.6 9.66,50.16 v9.41,50.41
  Bottom 0.152: v9.41,50.41 1.02,50.41 0.77,50.16 0.77,40.25 CON-B.12
Q19  (via drill 0.3)
  Top 0.152: IC3.4 20.29,35.71 19.82,36.19 19.31,36.19 v19.06,36.44 | v18.3,49.39 11.95,49.39 v9.66,51.68
  Bottom 0.152: v19.06,36.44 19.06,48.63 v18.3,49.39 | v9.66,51.68 8.39,52.95 3.31,52.95 CON-B.2
Q20  (via drill 0.3)
  Top 0.152: IC3.48 21.84,22.87 v22.61,22.1
  Bottom 0.152: v22.61,22.1 22.61,21.08 TP1.PP
Q21  (via drill 0.3)
  Top 0.152: IC3.44 19.79,20.72 v20.58,19.93
  Bottom 0.152: v20.58,19.93 20.58,19.55 TP3.PP
Q22  (via drill 0.3)
  Top 0.152: IC3.40 17.79,23.74 v18.42,24.25
  Bottom 0.152: v18.42,24.25 18.8,24.25 22.11,20.95 22.11,19.8 TP2.PP
Q23
  Top 0.152: IC3.36 15.79,21.49 15.25,20.95 7.12,20.95 7.12,10.53 6.36,9.77 3.31,9.77 CON-B.34
Q24
  Top 0.152: IC3.32 6.04,24.82 5.85,25.01 3.31,25.01 CON-B.24
Q25
  Top 0.152: CON-B.14 3.31,35.17 6.36,35.17 6.87,34.66 6.87,27.8 7.88,26.79 12.31,26.79 IC3.28
RST  (via drill 0.3)
  Top 0.152: v26.42,29.84 25.4,28.82 IC3.57
  Top 0.305: v22.02,54.68 IC2.2 | IC2.2 23.3,54.65 | 25.53,59.7 JTAG.15 23.3,57.41 IC2.2 | IC2.2 23.36,54.68 23.41,54.73 24.28,53.86 v24.28,53.67
  Bottom 0.152: v26.42,29.84 26.42,33.65 20.88,39.19 20.85,39.19 20.85,52.84 21.98,53.97 21.98,54.64 v22.02,54.68
  Bottom 0.305: v24.28,53.67 24.28,53.6 26.2,51.68 CON-A.18
RTCK  (via drill 0.3)
  Top 0.152: v10.17,28.82 IC3.24
  Top 0.305: v13.48,52.37 15.29,52.37 15.9,51.89 16.43,51.35 19.12,51.35 21.23,53.46 v21.23,54.96
  Bottom 0.152: v10.17,28.82 9.41,29.58 9.41,32.63 13.48,36.71 v13.48,52.37
  Bottom 0.305: 20.4,59.7 JTAG.11 | 20.45,59.63 20.38,59.55 | JTAG.11 20.45,59.63 | 20.45,59.63 21.65,60.82 21.65,62.86 24.17,65.38 24.17,67.97 R10.1 | JTAG.11 20.36,59.55 21.23,58.68 v21.23,54.96
RTXC1
  Top 0.152: C2.1 15.67,40.58 Q2.2 18.29,35.68 19.82,35.68 19.82,34.29 IC3.5
  Bottom 0.152: CON-B.19 6.36,27.04 14.49,27.04 15.5,28.06 15.5,37.71 15.67,37.88 Q2.2
RTXC2
  Top 0.152: C1.1 18.21,40.67 Q2.1 20.79,35.72 IC3.3
TCK  (via drill 0.3)
  Top 0.152: 17.8,59.53 17.79,54.98 17.79,53.91 v16.53,53.16 | v20.84,31.11 20.84,29.33 21.85,28.31 IC3.56
  Top 0.305: v19.09,64.38 10.46,64.38 v9.69,65.14 | JTAG.9 18.08,59.81 | JTAG.9 | 17.8,59.53 JTAG.9
  Bottom 0.152: v16.53,53.16 16.53,36.65 17.07,36.65 20.84,32.88 v20.84,31.11
  Bottom 0.305: 7.63,69.97 R11.2 7.63,69.94 7.66,69.97 9.19,69.97 9.69,69.46 v9.69,65.14 | JTAG.9 19.11,60.85 19.09,60.87 v19.09,64.38
TDI  (via drill 0.3)
  Top 0.152: IC3.60 23.71,30.34 v22.36,30.34
  Top 0.305: JTAG.5 12.74,59.55 15.28,57.01 v16.04,57.01
  Bottom 0.152: v16.04,57.01 19.57,57.01 19.57,38.98 22.36,36.19 v22.36,30.34
  Bottom 0.305: 12.93,59.6 12.88,59.65 JTAG.5 | JTAG.5 12.92,59.65 13.01,59.55 14.03,60.57 14.03,63.63 16.04,65.65 16.04,67.94 16.01,67.97 R7.1 | JTAG.5 12.9,59.65
TDO  (via drill 0.3)
  Top 0.152: v23.38,34.66 23.38,32.68 IC3.64 | v20.33,53.71 20.33,57.01 20.36,57.01 JTAG.13
  Bottom 0.152: v20.33,53.71 20.33,38.98 23.38,35.93 v23.38,34.66
  Bottom 0.305: JTAG.13 22.99,59.63 24.19,60.82 24.19,63.11 25.97,64.89 27.73,64.89 28.49,65.65 28.49,68.03 | 28.49,68.03 28.49,68.19 | 28.49,68.03 R9.1
TMS  (via drill 0.3)
  Top 0.152: v22.11,26.53 22.32,26.32 IC3.52
  Top 0.305: JTAG.7 15.54,59.81 16.81,58.54 v16.81,55.49
  Bottom 0.152: v16.81,55.49 17.17,54.87 17.17,37.57 21.6,33.14 21.6,27.04 v22.11,26.53
  Bottom 0.305: JTAG.7 15.37,59.73 15.3,59.81 16.57,61.08 16.57,64.4 20.11,67.94 20.08,67.97 R8.1
TRST  (via drill 0.3)
  Top 0.152: IC3.20 12.38,30.85 v13.72,30.85
  Bottom 0.152: 10.46,59.3 10.46,58.28 10.96,57.78 14.27,57.78 14.74,57.49 14.74,31.87 v13.72,30.85
  Bottom 0.305: JTAG.3 | 11.95,67.94 R6.1 11.95,67.97 11.98,67.94 11.47,67.43 11.47,60.82 JTAG.3 | JTAG.3 10.2,59.55 10.46,59.3
VBAT  (via drill 0.3)
  Top 0.152: v8.64,41.52 8.64,41.01 9.91,39.74 9.91,36.19 10.68,35.42 12.45,35.42 13.22,34.66 13.22,33.14 14.23,32.12 17.28,32.12 21.09,28.31 v21.09,26.53 | v22.36,24.5 22.67,24.82 IC3.49
  Top 0.305: D1.3 8.9,54.47 8.64,54.22 v8.64,41.52
  Bottom 0.152: CON-B.9 v8.64,41.52 | v21.09,26.53 21.09,26.28 21.6,25.77 21.6,25.26 v22.36,24.5
VBATEXT
  Top 0.305: D1.2 12.05,55.42 11.98,55.49 3.82,55.49 3.31,54.98 3.31,47.87 CON-B.5
VCCUSB  (via drill 0.3)
  Top 0.152: IC3.58 22.37,29.32 v22.36,29.33
  Bottom 0.152: v22.36,29.33 22.36,29.07 23.63,27.8 23.63,24.5 24.65,23.49 24.65,16.12 23.38,14.85 14.57,14.85 R13.1 R16.2
VDDA  (via drill 0.3)
  Top 0.152: v26.93,26.79 26.34,26.2 C7.1 | IC3.7 18.79,33.38 18.55,33.14 18.55,32.38 19.06,31.87 23.69,31.87 IC3.63 23.79,31.87 25.15,31.87 v25.66,32.38
  Bottom 0.152: L1.1 26.42,26.28 v26.93,26.79 25.79,26.79 25.79,32.25 v25.66,32.38
X1
  Top 0.152: C4.1 29.33,40.56 Q1.2 28.47,34.42 28.46,34.41 28.46,32.63 26.68,30.85 23.78,30.85 IC3.61
X2
  Top 0.152: C3.1 23.77,39.82 Q1.1 25.96,39.7 26.68,38.98 26.68,31.61 26.42,31.36 23.79,31.36 IC3.62

### Text on the board
Bottom: boards@seip.net
tNames: JTAG PULLUP ENABLE | MCUBOARD-2 | V 1.0 | C | B | A | 1 | RST | 3 | GND | 5 | I2CPU | 3.3V | 7 | 14 | 9 | 13 | 11 | 12 | 13 | LPC214x | 11 | 15 | 10 | 17 | 9 | 19 | 8 | 21 | KENZABURO V.1 | 7 | 23 | 25 | 6 | 5 | 27 | 4 | 29 | 31 | 33 | 35 | EXT | USB